# EAGLE design octostep (EAGLE 7.6.0)
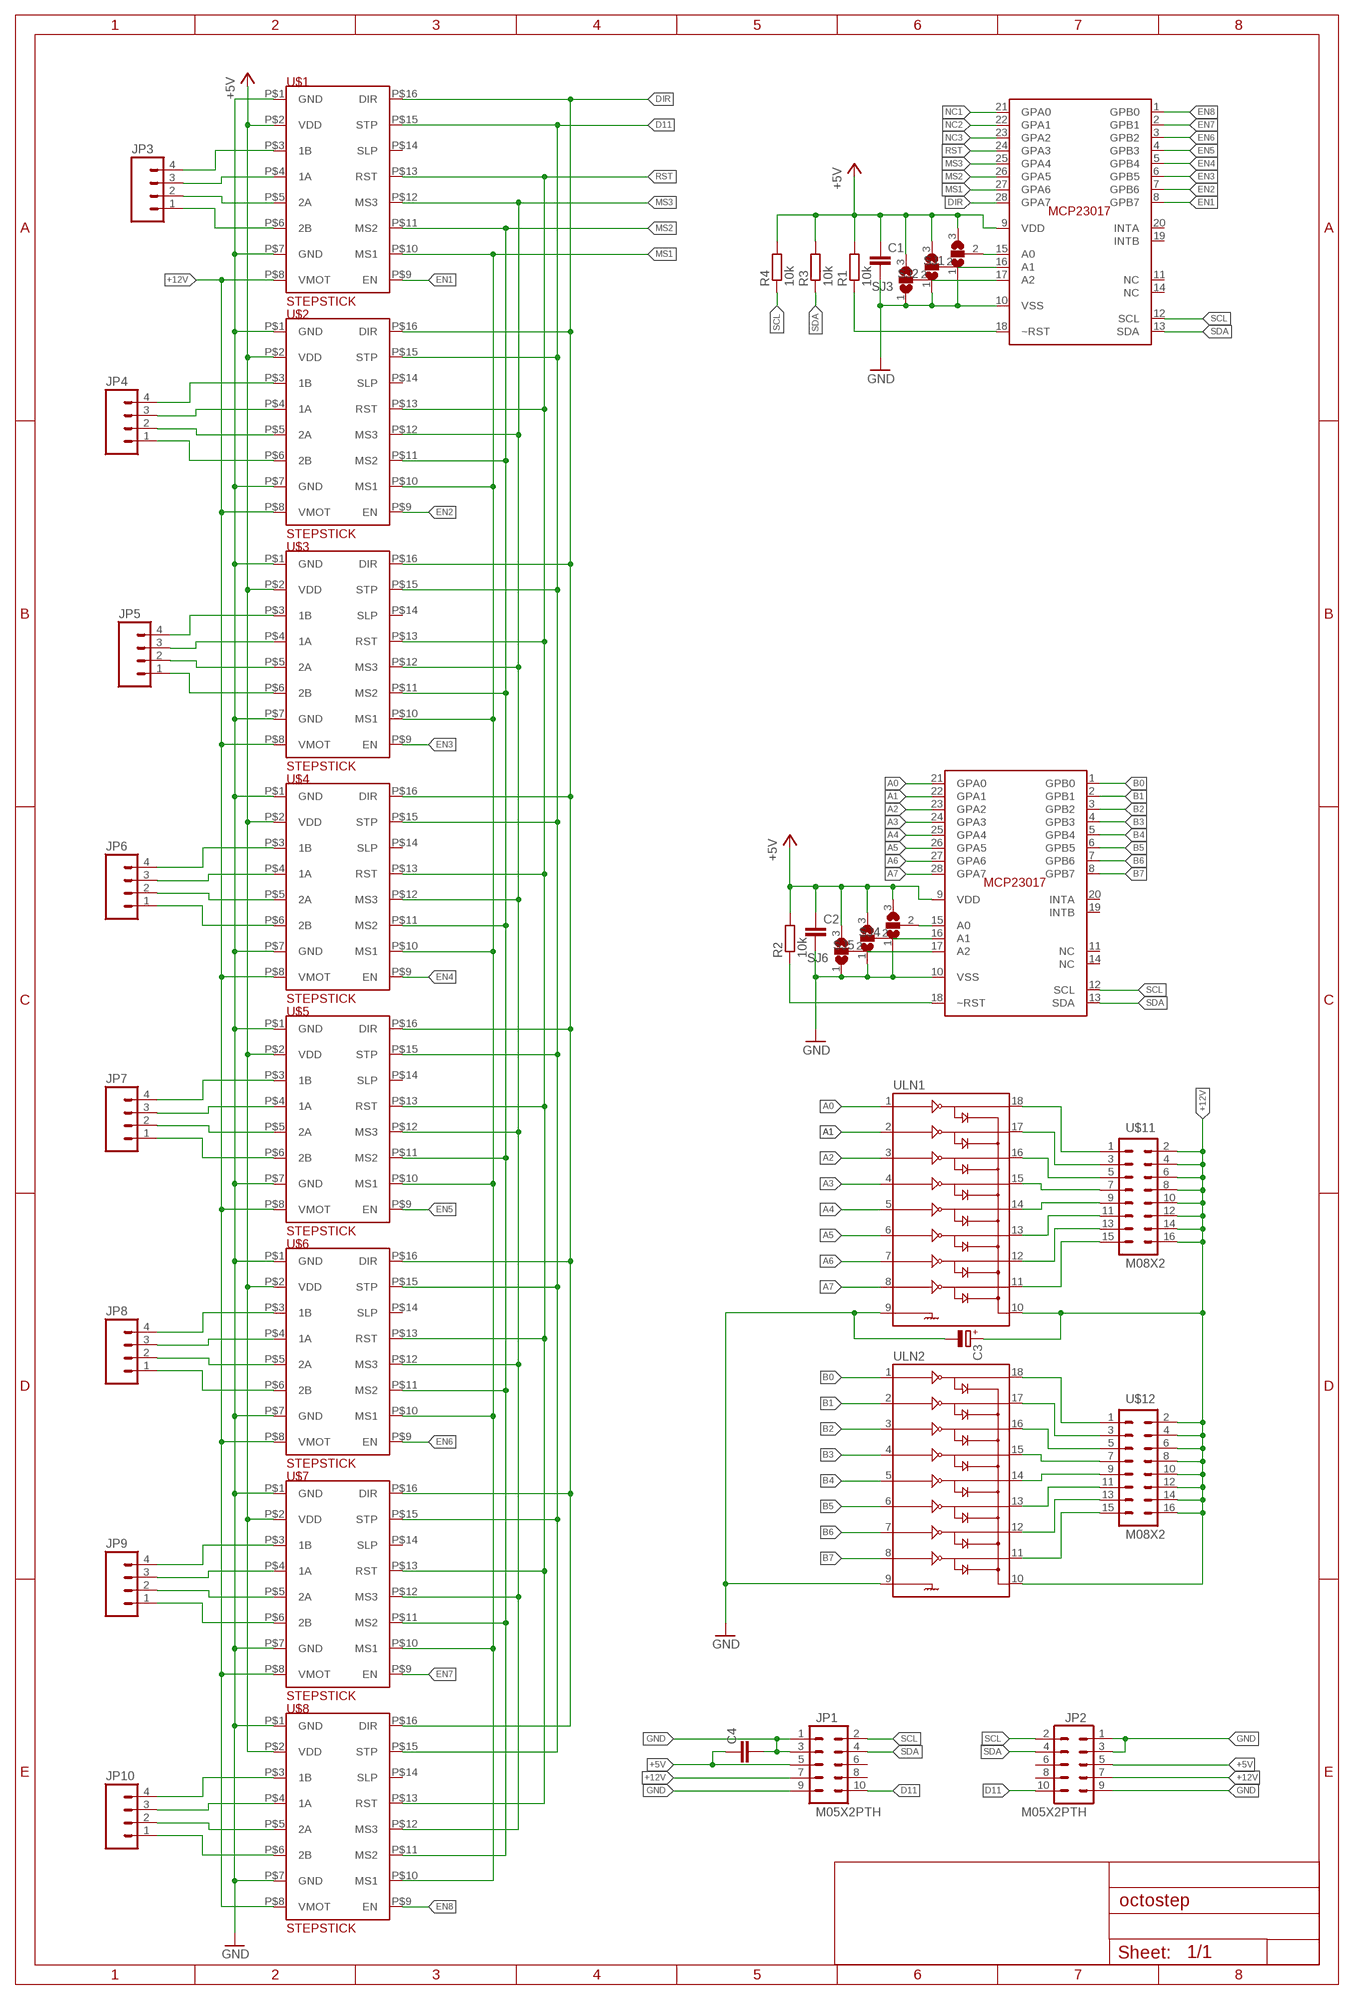
[diagram p0: schematic, sheet 1]

## Parts
C1  CAP0805  [0805]
C2  CAP0805  [0805]
C3  CPOL-EUE3.5-10  [E3,5-10]
C4  C-EUC1206K  [C1206K]
JP1  M05X2PTH  [AVR_ICSP]
JP2  M05X2PTH  [AVR_ICSP]
JP3  M04POLAR  [MOLEX-1X4]
JP4  M04POLAR  [MOLEX-1X4]
JP5  M04POLAR  [MOLEX-1X4]
JP6  M04POLAR  [MOLEX-1X4]
JP7  M04POLAR  [MOLEX-1X4]
JP8  M04POLAR  [MOLEX-1X4]
JP9  M04POLAR  [MOLEX-1X4]
JP10  M04POLAR  [MOLEX-1X4]
R1  10k  R-EU_R0805  [R0805]
R2  10k  R-EU_R0805  [R0805]
R3  10k  R-EU_R0805  [R0805]
R4  10k  R-EU_R0805  [R0805]
SJ1  SJ2W  [SJ_2]
SJ2  SJ2W  [SJ_2]
SJ3  SJ2W  [SJ_2]
SJ4  SJ2W  [SJ_2]
SJ5  SJ2W  [SJ_2]
SJ6  SJ2W  [SJ_2]
U$1  STEPSTICK  [STEPSTICK]
U$2  STEPSTICK  [STEPSTICK]
U$3  STEPSTICK  [STEPSTICK]
U$4  STEPSTICK  [STEPSTICK]
U$5  STEPSTICK  [STEPSTICK]
U$6  STEPSTICK  [STEPSTICK]
U$7  STEPSTICK  [STEPSTICK]
U$8  STEPSTICK  [STEPSTICK]
U$9  MCP23017-E/SO  [SOIC28-W_MC]
U$10  MCP23017-E/SO  [SOIC28-W_MC]
U$11  M08X2  [2X8]
U$12  M08X2  [2X8]
ULN1  ULN2803SOICW  [SO18L]
ULN2  ULN2803SOICW  [SO18L]

## Nets
+5V: C1.1 C2.1 C4.1 JP1.5 JP2.5 R1.2 R2.2 R3.2 R4.2 SJ1.3 SJ2.3 SJ3.3 SJ4.3 SJ5.3 SJ6.3 U$1.P$2(VDD) U$2.P$2(VDD) U$3.P$2(VDD) U$4.P$2(VDD) U$5.P$2(VDD) U$6.P$2(VDD) U$7.P$2(VDD) U$8.P$2(VDD) U$9.9(VDD) U$10.9(VDD)
+12V: C3.+ JP1.7 JP2.7 U$1.P$8(VMOT) U$2.P$8(VMOT) U$3.P$8(VMOT) U$4.P$8(VMOT) U$5.P$8(VMOT) U$6.P$8(VMOT) U$7.P$8(VMOT) U$8.P$8(VMOT) U$11.2 U$11.4 U$11.6 U$11.8 U$11.10 U$11.12 U$11.14 U$11.16 U$12.2 U$12.4 U$12.6 U$12.8 U$12.10 U$12.12 U$12.14 U$12.16 ULN1.10
A0: U$10.21(GPA0) ULN1.1
A1: U$10.22(GPA1) ULN1.2
A2: U$10.23(GPA2) ULN1.3
A3: U$10.24(GPA3) ULN1.4
A4: U$10.25(GPA4) ULN1.5
A5: U$10.26(GPA5) ULN1.6
A6: U$10.27(GPA6) ULN1.7
A7: U$10.28(GPA7) ULN1.8
B0: U$10.1(GPB0) ULN2.1
B1: U$10.2(GPB1) ULN2.2
B2: U$10.3(GPB2) ULN2.3
B3: U$10.4(GPB3) ULN2.4
B4: U$10.5(GPB4) ULN2.5
B5: U$10.6(GPB5) ULN2.6
B6: U$10.7(GPB6) ULN2.7
B7: U$10.8(GPB7) ULN2.8
D11: JP1.10 JP2.10 U$1.P$15(STP) U$2.P$15(STP) U$3.P$15(STP) U$4.P$15(STP) U$5.P$15(STP) U$6.P$15(STP) U$7.P$15(STP) U$8.P$15(STP)
DIR: U$1.P$16(DIR) U$2.P$16(DIR) U$3.P$16(DIR) U$4.P$16(DIR) U$5.P$16(DIR) U$6.P$16(DIR) U$7.P$16(DIR) U$8.P$16(DIR) U$9.28(GPA7)
EN1: U$1.P$9(EN) U$9.8(GPB7)
EN2: U$2.P$9(EN) U$9.7(GPB6)
EN3: U$3.P$9(EN) U$9.6(GPB5)
EN4: U$4.P$9(EN) U$9.5(GPB4)
EN5: U$5.P$9(EN) U$9.4(GPB3)
EN6: U$6.P$9(EN) U$9.3(GPB2)
EN7: U$7.P$9(EN) U$9.2(GPB1)
EN8: U$8.P$9(EN) U$9.1(GPB0)
GND: C1.2 C2.2 C3.- C4.2 JP1.1 JP1.3 JP1.9 JP2.1 JP2.3 JP2.9 SJ1.1 SJ2.1 SJ3.1 SJ4.1 SJ5.1 SJ6.1 U$1.P$1(GND) U$1.P$7(GND) U$2.P$1(GND) U$2.P$7(GND) U$3.P$1(GND) U$3.P$7(GND) U$4.P$1(GND) U$4.P$7(GND) U$5.P$1(GND) U$5.P$7(GND) U$6.P$1(GND) U$6.P$7(GND) U$7.P$1(GND) U$7.P$7(GND) U$8.P$1(GND) U$8.P$7(GND) U$9.10(VSS) U$10.10(VSS) ULN1.9 ULN2.9
MS1: U$1.P$10(MS1) U$2.P$10(MS1) U$3.P$10(MS1) U$4.P$10(MS1) U$5.P$10(MS1) U$6.P$10(MS1) U$7.P$10(MS1) U$8.P$10(MS1) U$9.27(GPA6)
MS2: U$1.P$11(MS2) U$2.P$11(MS2) U$3.P$11(MS2) U$4.P$11(MS2) U$5.P$11(MS2) U$6.P$11(MS2) U$7.P$11(MS2) U$8.P$11(MS2) U$9.26(GPA5)
MS3: U$1.P$12(MS3) U$2.P$12(MS3) U$3.P$12(MS3) U$4.P$12(MS3) U$5.P$12(MS3) U$6.P$12(MS3) U$7.P$12(MS3) U$8.P$12(MS3) U$9.25(GPA4)
N$1: JP3.2 U$1.P$5(2A)
N$2: SJ2.2 U$9.16(A1)
N$4: R1.1 U$9.18(~RST)
N$5: SJ1.2 U$9.15(A0)
N$6: SJ3.2 U$9.17(A2)
N$7: R2.1 U$10.18(~RST)
N$8: SJ4.2 U$10.15(A0)
N$9: SJ5.2 U$10.16(A1)
N$10: SJ6.2 U$10.17(A2)
N$11: JP3.3 U$1.P$4(1A)
N$12: JP3.4 U$1.P$3(1B)
N$13: JP3.1 U$1.P$6(2B)
N$14: JP4.2 U$2.P$5(2A)
N$15: JP4.3 U$2.P$4(1A)
N$16: JP4.4 U$2.P$3(1B)
N$17: JP4.1 U$2.P$6(2B)
N$18: JP5.2 U$3.P$5(2A)
N$19: JP5.3 U$3.P$4(1A)
N$20: JP5.4 U$3.P$3(1B)
N$21: JP5.1 U$3.P$6(2B)
N$22: JP6.2 U$4.P$5(2A)
N$23: JP6.3 U$4.P$4(1A)
N$24: JP6.4 U$4.P$3(1B)
N$25: JP6.1 U$4.P$6(2B)
N$26: JP7.2 U$5.P$5(2A)
N$27: JP7.3 U$5.P$4(1A)
N$28: JP7.4 U$5.P$3(1B)
N$29: JP7.1 U$5.P$6(2B)
N$30: JP8.2 U$6.P$5(2A)
N$31: JP8.3 U$6.P$4(1A)
N$32: JP8.4 U$6.P$3(1B)
N$33: JP8.1 U$6.P$6(2B)
N$34: JP9.2 U$7.P$5(2A)
N$35: JP9.3 U$7.P$4(1A)
N$36: JP9.4 U$7.P$3(1B)
N$37: JP9.1 U$7.P$6(2B)
N$38: JP10.2 U$8.P$5(2A)
N$39: JP10.3 U$8.P$4(1A)
N$40: JP10.4 U$8.P$3(1B)
N$41: JP10.1 U$8.P$6(2B)
N$42: U$11.1 ULN1.18
N$43: U$11.3 ULN1.17
N$44: U$11.5 ULN1.16
N$45: U$11.7 ULN1.15
N$46: U$11.9 ULN1.14
N$47: U$11.11 ULN1.13
N$48: U$11.13 ULN1.12
N$49: U$11.15 ULN1.11
N$50: ULN2.10
N$51: U$12.1 ULN2.18
N$52: U$12.3 ULN2.17
N$53: U$12.5 ULN2.16
N$54: U$12.7 ULN2.15
N$55: U$12.9 ULN2.14
N$56: U$12.11 ULN2.13
N$57: U$12.13 ULN2.12
N$58: U$12.15 ULN2.11
NC1: U$9.21(GPA0)
NC2: U$9.22(GPA1)
NC3: U$9.23(GPA2)
RST: U$1.P$13(RST) U$2.P$13(RST) U$3.P$13(RST) U$4.P$13(RST) U$5.P$13(RST) U$6.P$13(RST) U$7.P$13(RST) U$8.P$13(RST) U$9.24(GPA3)
SCL: JP1.2 JP2.2 R4.1 U$9.12(SCL) U$10.12(SCL)
SDA: JP1.4 JP2.4 R3.1 U$9.13(SDA) U$10.13(SDA)
Unconnected: JP1.6 JP1.8 JP2.6 JP2.8 U$1.P$14(SLP) U$2.P$14(SLP) U$3.P$14(SLP) U$4.P$14(SLP) U$5.P$14(SLP) U$6.P$14(SLP) U$7.P$14(SLP) U$8.P$14(SLP) U$9.11(NC) U$9.14(NC) U$9.19(INTB) U$9.20(INTA) U$10.11(NC) U$10.14(NC) U$10.19(INTB) U$10.20(INTA)

## Library data of the parts
C1 C2 = SparkFun-Capacitors:CAP: Capacitor Standard 0603 ceramic capacitor, and 0.1" leaded capacitor.
C3 = resistor:CPOL-EU: POLARIZED CAPACITOR, European symbol
C4 = resistor:C-EU: CAPACITOR, European symbol
JP1 JP2 = SparkFun-Connectors:M05X2: Header 5x2 Standard 10-pin dual row 0.1" header. Commonly used with AVR-ISP. Use with Spark Fun Electronics SKU: PRT-00778
JP3-JP10 = SparkFun-Connectors:M04: Header 4 Standard 4-pin 0.1" header. Use with straight break away headers (SKU : PRT-00116), right angle break away headers (PRT-00553), swiss pins (PRT-00743), machine pins (PRT-00117), and female headers (PRT-00115). Molex polarized connector foot print use with SKU : PRT-08231 with associated crimp pins and housings. 1MM SMD Version SKU: PRT-10208
R1-R4 = resistor:R-EU_: RESISTOR, European symbol
SJ1-SJ6 = jumper:SJ2W: SMD solder JUMPER
U$1-U$8 = Allegro_By_element14_Batch_1:STEPSTICK
U$9 U$10 = Microchip_By_element14_Batch_1:MCP23017-E/SO
U$11 U$12 = SparkFun-Connectors:M08X2: .1" headers, two rows of 8 each
ULN1 ULN2 = SparkFun-PowerIC:ULN2803: Darlington Driver ULN2803 Darlington array. 500mA max per channel, 8-channel package. Spark Fun Electronics SKU : COM-00312

## Board
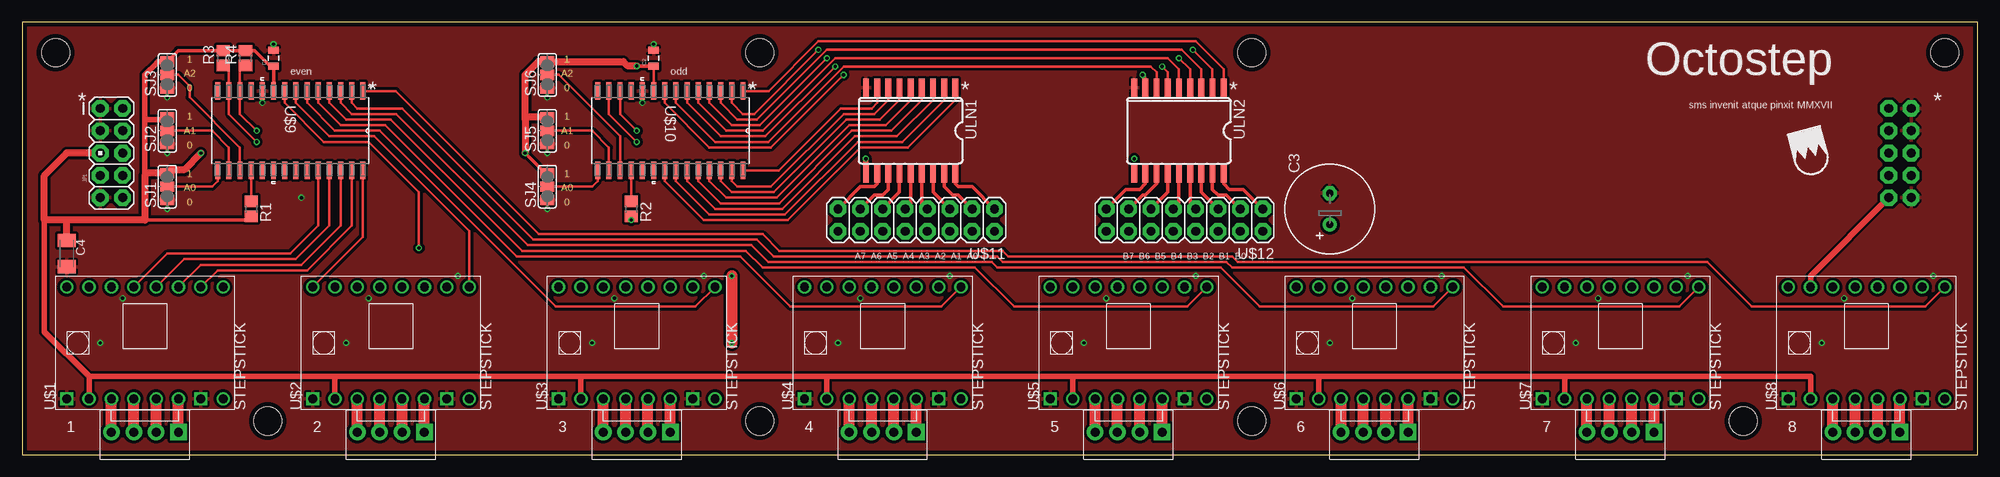
[diagram p1: board, top side]
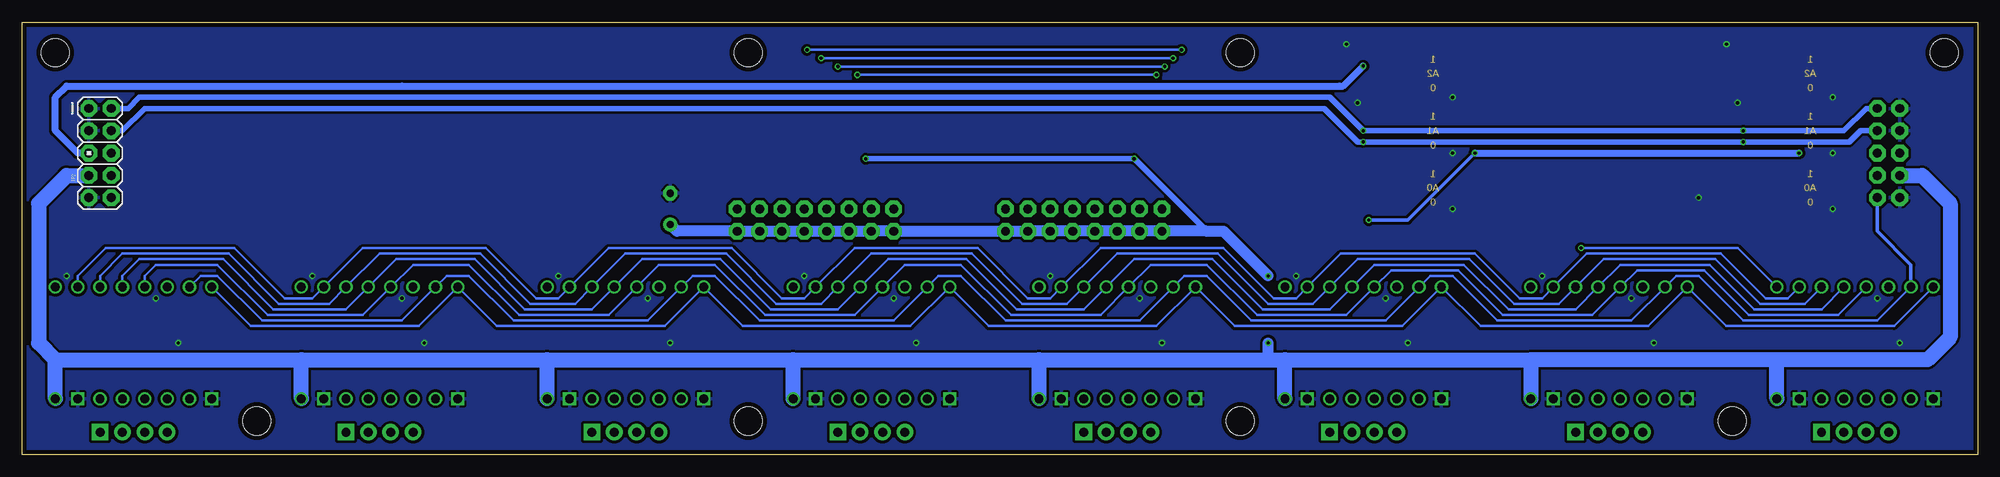
[diagram p2: board, bottom side, seen from below]

Size 222.23 x 49.2 mm. Coordinates in mm from the lower left corner, seen from the top.
Outline: 0,0 222.23,0 222.23,49.2 0,49.2 0,0
Copper layers (1*16): Top 0.035mm / dielectric 1.6mm / Bottom 0.035mm
Design rules "Elecrow_2-layer_PCB_eagle_rule": minimum track width 6mil, minimum drill 12mil, track to track 6mil, track to pad 8mil, pad to pad 12mil, via to via 12mil, smd to smd 0mil, copper to edge 20mil, drill to drill 10mil, minimum pad ring 6mil, minimum via ring 6mil, stop-mask expansion 0mil, vias tented up to drill 100mil, thermal gap 10mil
Holes 3.2 mm at 3.81,45.72 218.44,45.72 139.7,45.72 27.94,3.81 83.82,3.81 139.7,3.81 195.58,3.81 83.82,45.72

### Footprints (pad centres in the part's own frame; a part is rotated, then mirrored left to right if it is on the bottom)
0805 = smd 0.8 x 1.2: 1 -0.9,0; 2 0.9,0
E3,5-10 = drill 0.813 pad 1.6: + -1.778,0 | drill 0.813 pad 1.6 octagon: - 1.778,0
C1206K = smd 1.5 x 2: 1 -1.5,0; 2 1.5,0
AVR_ICSP = drill 1.016 pad 1.88 octagon: 1 -1.27,5.08; 2 1.27,5.08; 3 -1.27,2.54; 4 1.27,2.54; 5 -1.27,0; 6 1.27,0; 7 -1.27,-2.54; 8 1.27,-2.54; 9 -1.27,-5.08; 10 1.27,-5.08
MOLEX-1X4 = drill 1.016 pad 1.88 square: 1 0,0 | drill 1.016 pad 1.88: 2 2.54,0; 3 5.08,0; 4 7.62,0
R0805 = smd 1.3 x 1.5: 1 -0.85,0; 2 0.85,0
SJ_2 = smd 1.168 x 1.6: 1 -1.524,0; 2 0,0; 3 1.524,0
STEPSTICK = drill 1 square: P$1 -6.35,8.89; P$7 -6.35,-6.35 | drill 1: P$2 -6.35,6.35; P$3 -6.35,3.81; P$4 -6.35,1.27; P$5 -6.35,-1.27; P$6 -6.35,-3.81; P$8 -6.35,-8.89; P$9 6.35,-8.89; P$10 6.35,-6.35; P$11 6.35,-3.81; P$12 6.35,-1.27; P$13 6.35,1.27; P$14 6.35,3.81; P$15 6.35,6.35; P$16 6.35,8.89
SOIC28-W_MC = smd 1.981 x 0.559: 1 -4.521,8.255; 2 -4.521,6.985; 3 -4.521,5.715; 4 -4.521,4.445; 5 -4.521,3.175; 6 -4.521,1.905; 7 -4.521,0.635; 8 -4.521,-0.635; 9 -4.521,-1.905; 10 -4.521,-3.175; 11 -4.521,-4.445; 12 -4.521,-5.715; 13 -4.521,-6.985; 14 -4.521,-8.255; 15 4.521,-8.255; 16 4.521,-6.985; 17 4.521,-5.715; 18 4.521,-4.445; 19 4.521,-3.175; 20 4.521,-1.905; 21 4.521,-0.635; 22 4.521,0.635; 23 4.521,1.905; 24 4.521,3.175; 25 4.521,4.445; 26 4.521,5.715; 27 4.521,6.985; 28 4.521,8.255
2X8 = drill 1.016 pad 1.88 octagon: 1 0,0; 2 0,2.54; 3 2.54,0; 4 2.54,2.54; 5 5.08,0; 6 5.08,2.54; 7 7.62,0; 8 7.62,2.54; 9 10.16,0; 10 10.16,2.54; 11 12.7,0; 12 12.7,2.54; 13 15.24,0; 14 15.24,2.54; 15 17.78,0; 16 17.78,2.54
SO18L = smd 0.66 x 2.032: 1 -0.635,-4.902; 2 0.635,-4.902; 3 1.905,-4.902; 4 3.175,-4.902; 5 4.445,-4.902; 6 5.715,-4.902; 7 6.985,-4.902; 8 8.255,-4.902; 9 9.525,-4.902; 10 9.525,4.902; 11 8.255,4.902; 12 6.985,4.902; 13 5.715,4.902; 14 4.445,4.902; 15 3.175,4.902; 16 1.905,4.902; 17 0.635,4.902; 18 -0.635,4.902

### Placement (x,y rotation side)
C1  28.57,45.09 90 top
C2  71.75,45.09 90 top
C3  148.59,27.94 90 top
C4  5.08,22.86 270 top
JP1  10.16,34.29 0 top
JP2  213.36,34.29 0 bottom
JP3  17.78,2.54 180 top
JP4  45.72,2.54 180 top
JP5  73.66,2.54 180 top
JP6  101.6,2.54 180 top
JP7  129.54,2.54 180 top
JP8  157.48,2.54 180 top
JP9  185.42,2.54 180 top
JP10  213.36,2.54 180 top
R1  26.04,27.94 270 top
R2  69.22,27.94 270 top
R3  22.86,45.09 90 top
R4  25.4,45.09 90 top
SJ1  16.51,30.48 90 top
SJ2  16.51,36.83 90 top
SJ3  16.51,43.18 90 top
SJ4  59.69,30.48 90 top
SJ5  59.69,36.83 90 top
SJ6  59.69,43.18 90 top
U$1  13.97,12.7 90 top
U$2  41.91,12.7 90 top
U$3  69.85,12.7 90 top
U$4  97.79,12.7 90 top
U$5  125.73,12.7 90 top
U$6  153.67,12.7 90 top
U$7  181.61,12.7 90 top
U$8  209.55,12.7 90 top
U$9  30.48,36.83 270 top
U$10  73.66,36.83 270 top
U$11  110.49,27.94 180 top
U$12  140.97,27.94 180 top
ULN1  105.41,36.83 180 top
ULN2  135.89,36.83 180 top

### Tracks (layer width: path | path; a pad name or v marks a point on that pad's centre or on a via)
+5V  (via drill 0.38)
  Top 0.305: U$10.9 C2.1 | R1.2 25.82,27.09 25.4,26.67 | C1.1 28.2,44.19 | SJ2.3 16.26,38.1 | 16.26,31.75 SJ1.3
  Top 0.406: U$9.9 C1.1 | 28.2,44.19 26.45,45.94 R4.2 R3.2 17.74,45.94 SJ3.3 | 57.4,38.35 57.15,38.1 | 25.4,26.67 13.97,26.67 | C2.1 v69.85,44.19 | SJ4.3 59.44,32 v57.15,34.29 | R2.2 v69.22,26.67
  Top 0.61: 13.97,31.75 13.97,38.1 | 13.97,38.1 13.97,43.18 15.24,44.45 15.49,44.7 SJ3.3 | 16.26,38.1 13.97,38.1 | U$8.P$2 203.2,8.89 175.26,8.89 | 175.26,8.89 147.32,8.89 | 147.32,8.89 119.38,8.89 | 119.38,8.89 91.44,8.89 | 91.44,8.89 63.5,8.89 | 63.5,8.89 35.56,8.89 | 35.56,8.89 7.62,8.89 | U$1.P$2 7.62,8.89 | U$2.P$2 35.56,8.89 | U$3.P$2 63.5,8.89 | U$4.P$2 91.44,8.89 | U$5.P$2 119.38,8.89 | U$6.P$2 147.32,8.89 | U$7.P$2 175.26,8.89 | 7.62,8.89 2.54,13.97 2.54,26.67
  Top 0.813: SJ5.3 57.4,38.35 | v69.85,44.19 68.84,44.19 68.33,44.7 SJ6.3 58.67,44.7 57.15,43.18 57.15,38.1 v57.15,34.29 | JP1.5 5.08,34.29 2.54,31.75 2.54,26.67 5.08,26.67 | 5.08,26.67 13.97,26.67 13.97,31.75 14.22,32 SJ1.3 16.89,32.38 18.41,32.38 v20.32,34.29 | C4.1 5.08,26.67
  Bottom 0.406: v69.22,26.67 64.77,26.67 v57.15,34.29
  Bottom 0.813: v57.15,34.29 v20.32,34.29 | JP2.5 215.9,34.29 218.44,36.83 218.44,40.64 217.17,41.91 179.07,41.91 72.55,41.91 72.12,41.91 v69.85,44.19
+12V  (via drill 0.38)
  Top 0.61: ULN1.10 v95.89,33.66
  Top 1.27: v80.64,20.32 v80.64,12.7
  Bottom 0.61: 87.63,25.4 v95.89,33.66 v126.36,33.66
  Bottom 1.27: v80.64,20.32 85.72,25.4 87.63,25.4 U$11.16 U$11.14 U$11.12 U$11.10 U$11.8 U$11.6 U$11.4 U$11.2 U$12.16 U$12.14 U$12.12 U$12.10 U$12.8 U$12.6 U$12.4 U$12.2 147.83,25.4 C3.+ | 80.64,10.79 v80.64,12.7
  Bottom 1.676: U$1.P$8 22.86,10.79 | 22.86,10.79 50.8,10.79 | U$3.P$8 78.74,10.79 | 78.74,10.79 50.8,10.79 | U$4.P$8 106.68,10.79 | 106.68,10.79 80.64,10.79 78.74,10.79 | U$5.P$8 134.62,10.79 | 134.62,10.79 106.68,10.79 | U$6.P$8 162.56,10.79 | 162.56,10.79 134.62,10.79 | U$7.P$8 190.5,10.79 | 190.5,10.79 162.56,10.79 | U$8.P$8 218.44,10.79 | 218.44,10.79 190.5,10.79 | 50.8,10.79 U$2.P$8 | 22.86,10.79 5.71,10.79 3.17,13.34 3.17,28.57 6.35,31.75 JP1.7 | 218.44,10.79 220.34,12.7 220.34,28.57 217.17,31.75 JP2.7
A0
  Top 0.305: ULN1.1 106.05,40.32 100.65,34.92 95.25,34.92 87,26.67 77.47,26.67 73.03,31.11 U$10.21
A1
  Top 0.305: U$10.22 74.3,31.11 78.11,27.3 86.68,27.3 94.93,35.56 100.01,35.56 104.78,40.32 ULN1.2
A2
  Top 0.305: U$10.23 75.56,31.11 78.74,27.94 86.36,27.94 94.61,36.2 99.38,36.2 103.5,40.32 ULN1.3
A3
  Top 0.305: U$10.24 76.83,31.11 79.38,28.57 86.04,28.57 94.3,36.83 98.74,36.83 102.23,40.32 ULN1.4
A4
  Top 0.305: U$10.25 78.11,31.11 80.01,29.21 85.72,29.21 93.98,37.47 98.11,37.47 100.97,40.32 ULN1.5
A5
  Top 0.305: U$10.26 79.38,31.11 80.64,29.84 85.41,29.84 93.66,38.1 97.47,38.1 99.69,40.32 ULN1.6
A6
  Top 0.305: ULN1.7 98.42,40.32 96.84,38.73 93.34,38.73 85.09,30.48 81.28,30.48 80.64,31.11 U$10.27
A7
  Top 0.305: U$10.28 85.97,32.31 93.03,39.37 96.52,39.37 97.16,40.01 ULN1.8
B0
  Top 0.305: ULN2.1 136.53,43.81 133.35,46.99 90.49,46.99 84.85,41.35 U$10.1
B1  (via drill 0.38)
  Top 0.305: U$10.2 80.64,40.01 81.92,38.73 83.19,38.73 v90.49,46.04 | v133.03,46.04 135.25,43.81 ULN2.2
  Bottom 0.305: v90.49,46.04 v133.03,46.04
B2
  Top 0.305: U$10.3 79.38,40.01 81.28,38.1 83.5,38.1 91.44,46.04 131.76,46.04 133.99,43.81 ULN2.3
B3  (via drill 0.38)
  Top 0.305: U$10.4 78.11,40.01 80.64,37.47 83.82,37.47 v91.44,45.09 | v131.44,45.09 132.72,43.81 ULN2.4
  Bottom 0.305: v91.44,45.09 v131.44,45.09
B4
  Top 0.305: U$10.5 76.83,40.01 80.01,36.83 84.14,36.83 92.39,45.09 130.18,45.09 131.44,43.81 ULN2.5
B5  (via drill 0.38)
  Top 0.305: U$10.6 75.56,40.01 79.38,36.2 84.45,36.2 v92.39,44.13 | ULN2.6 130.18,43.5 v129.54,44.13
  Bottom 0.305: v92.39,44.13 v129.54,44.13
B6
  Top 0.305: U$10.7 74.3,40.01 78.74,35.56 84.77,35.56 93.34,44.13 128.27,44.13 128.91,43.5 ULN2.7
B7  (via drill 0.38)
  Top 0.305: U$10.8 73.03,40.01 78.11,34.92 85.09,34.92 v93.34,43.18 | ULN2.8 127.64,42.86 v127.32,43.18
  Bottom 0.305: v93.34,43.18 v127.32,43.18
D11
  Top 0.61: U$8.P$15 203.2,20.32 JP2.10
  Bottom 0.305: U$8.P$15 201.93,20.32 200.03,20.32 194.94,15.24 179.07,15.24 U$7.P$15 173.99,20.32 171.45,20.32 166.37,15.24 151.13,15.24 U$6.P$15 146.05,20.32 143.51,20.32 138.43,15.24 123.19,15.24 U$5.P$15 118.11,20.32 115.57,20.32 110.49,15.24 95.25,15.24 U$4.P$15 90.17,20.32 87.63,20.32 82.55,15.24 67.31,15.24 U$3.P$15 62.23,20.32 59.69,20.32 54.61,15.24 39.37,15.24 U$2.P$15 34.29,20.32 31.75,20.32 26.67,15.24 11.43,15.24 U$1.P$15
  Bottom 0.406: U$1.P$15 7.62,21.59 11.43,25.4 JP1.10
DIR
  Top 0.305: U$9.28 38.73,24.77 U$2.P$16
  Bottom 0.305: U$8.P$16 196.22,14.61 177.16,14.61 U$7.P$16 168.28,14.61 149.22,14.61 U$6.P$16 140.34,14.61 121.28,14.61 U$5.P$16 112.39,14.61 93.34,14.61 U$4.P$16 84.45,14.61 65.41,14.61 U$3.P$16 56.52,14.61 37.47,14.61 U$2.P$16 28.57,14.61 9.53,14.61 U$1.P$16
EN1  (via drill 0.38)
  Top 0.305: U$9.8 29.84,40.01 34.29,35.56 39.37,35.56 45.09,29.84 v45.09,23.5
  Bottom 0.305: U$1.P$9 27.3,23.5 v45.09,23.5
EN2
  Top 0.305: U$9.7 31.11,40.01 34.92,36.2 40.01,36.2 50.8,25.4 U$2.P$9
EN3
  Top 0.305: U$3.P$9 76.52,16.83 60.64,16.83 40.64,36.83 35.56,36.83 32.38,40.01 U$9.6
EN4
  Top 0.305: U$4.P$9 104.46,16.83 87.31,16.83 81.6,22.54 56.2,22.54 41.27,37.47 36.2,37.47 33.66,40.01 U$9.5
EN5
  Top 0.305: U$5.P$9 132.4,16.83 112.71,16.83 108.27,21.27 84.14,21.27 82.23,23.18 56.83,23.18 41.91,38.1 36.83,38.1 34.92,40.01 U$9.4
EN6
  Top 0.305: U$6.P$9 160.34,16.83 140.65,16.83 136.21,21.27 110.81,21.27 110.17,21.91 84.77,21.91 82.87,23.81 57.47,23.81 42.55,38.73 37.47,38.73 36.2,40.01 U$9.3
EN7
  Top 0.305: U$7.P$9 188.28,16.83 168.28,16.83 163.83,21.27 137.48,21.27 136.84,21.91 111.44,21.91 110.81,22.54 85.41,22.54 83.5,24.45 58.1,24.45 43.18,39.37 38.1,39.37 37.47,40.01 U$9.2
EN8
  Top 0.305: U$8.P$9 216.22,16.83 196.53,16.83 191.45,21.91 138.11,21.91 137.48,22.54 112.08,22.54 111.44,23.18 86.04,23.18 84.14,25.08 58.74,25.08 42.47,41.35 U$9.1
GND  (via drill 0.38)
  Top 0.305: SJ3.1 v16.51,40.64 | SJ2.1 v16.51,34.29 | SJ1.1 v16.51,27.94 | C1.2 v28.57,46.67 | U$9.10 v27.3,40.01 | SJ4.1 v59.69,27.94 | SJ5.1 v59.69,34.29 | SJ6.1 v59.69,40.64 | U$10.10 v70.48,40.01 | C2.2 v71.75,46.67
  other vias: 8.89,12.7 36.83,12.7 64.77,12.7 92.71,12.7 120.65,12.7 148.59,12.7 176.53,12.7 204.47,12.7 11.43,17.78 39.37,17.78 67.31,17.78 95.25,17.78 123.19,17.78 151.13,17.78 179.07,17.78 207.01,17.78 189.23,20.32 217.17,20.32 161.29,20.32 133.35,20.32 105.41,20.32 77.47,20.32 49.53,20.32 31.75,29.21
  pour Bottom (isolate 0.305): -3.81,52.07 224.79,52.07 224.79,-2.54 -3.81,-2.54
  pour Top (isolate 0.305): -1.27,53.34 224.79,52.07 224.79,-2.54 -1.27,-1.27
MS1
  Top 0.305: U$9.27 37.47,26.04 32.38,20.95 22.23,20.95 U$1.P$10
  Bottom 0.305: U$8.P$10 215.9,20.32 212.72,23.5 198.12,23.5 192.41,17.78 189.23,17.78 U$7.P$10 183.51,23.5 169.54,23.5 163.83,17.78 161.29,17.78 U$6.P$10 155.57,23.5 141.6,23.5 135.89,17.78 133.35,17.78 U$5.P$10 127.64,23.5 113.67,23.5 107.95,17.78 105.41,17.78 U$4.P$10 99.69,23.5 85.72,23.5 80.01,17.78 77.47,17.78 U$3.P$10 72.39,22.86 57.15,22.86 52.07,17.78 49.53,17.78 U$2.P$10 44.45,22.86 29.21,22.86 24.13,17.78 21.59,17.78 U$1.P$10
MS2
  Top 0.305: U$9.26 36.2,26.04 31.75,21.59 20.32,21.59 U$1.P$11
  Bottom 0.305: U$8.P$11 213.36,20.32 210.82,22.86 198.75,22.86 193.04,17.14 187.32,17.14 U$7.P$11 181.61,22.86 170.18,22.86 164.47,17.14 159.38,17.14 U$6.P$11 153.67,22.86 142.24,22.86 136.53,17.14 131.44,17.14 U$5.P$11 125.73,22.86 114.3,22.86 108.58,17.14 103.5,17.14 U$4.P$11 97.79,22.86 86.36,22.86 80.64,17.14 75.56,17.14 U$3.P$11 70.48,22.23 57.78,22.23 52.7,17.14 47.62,17.14 U$2.P$11 42.55,22.23 29.84,22.23 24.77,17.14 19.68,17.14 U$1.P$11
MS3
  Top 0.305: U$9.25 34.92,26.04 31.11,22.23 18.41,22.23 U$1.P$12
  Bottom 0.305: U$8.P$12 210.82,20.32 208.91,22.23 199.39,22.23 193.68,16.51 185.42,16.51 U$7.P$12 179.71,22.23 170.81,22.23 165.1,16.51 157.48,16.51 U$6.P$12 151.76,22.23 142.88,22.23 137.16,16.51 129.54,16.51 U$5.P$12 123.83,22.23 114.94,22.23 109.22,16.51 101.6,16.51 U$4.P$12 95.89,22.23 87,22.23 81.28,16.51 73.66,16.51 U$3.P$12 68.58,21.59 58.42,21.59 53.34,16.51 45.72,16.51 U$2.P$12 40.64,21.59 30.48,21.59 25.4,16.51 17.78,16.51 U$1.P$12
N$1
  Top 1.27: JP3.2 U$1.P$5
N$2
  Top 0.305: SJ2.2 21.59,36.83 23.5,34.92 U$9.16
N$4
  Top 0.305: U$9.18 R1.1
N$5
  Top 0.305: SJ1.2 21.59,30.48 22.23,31.11 U$9.15
N$6
  Top 0.305: SJ3.2 17.78,43.18 19.05,41.91 19.05,40.64 24.77,34.92 U$9.17
N$7
  Top 0.305: U$10.18 R2.1
N$8
  Top 0.305: U$10.15 65.41,31.11 64.77,30.48 SJ4.2
N$9
  Top 0.305: SJ5.2 64.77,36.83 66.67,34.92 U$10.16
N$10
  Top 0.305: SJ6.2 60.96,43.18 67.94,36.2 U$10.17
N$11
  Top 1.27: JP3.3 U$1.P$4
N$12
  Top 1.27: JP3.4 U$1.P$3
N$13
  Top 1.27: JP3.1 U$1.P$6
N$14
  Top 1.27: JP4.2 U$2.P$5
N$15
  Top 1.27: JP4.3 U$2.P$4
N$16
  Top 1.27: JP4.4 U$2.P$3
N$17
  Top 1.27: JP4.1 U$2.P$6
N$18
  Top 1.27: JP5.2 U$3.P$5
N$19
  Top 1.27: JP5.3 U$3.P$4
N$20
  Top 1.27: JP5.4 U$3.P$3
N$21
  Top 1.27: JP5.1 U$3.P$6
N$22
  Top 1.27: JP6.2 U$4.P$5
N$23
  Top 1.27: JP6.3 U$4.P$4
N$24
  Top 1.27: JP6.4 U$4.P$3
N$25
  Top 1.27: JP6.1 U$4.P$6
N$26
  Top 1.27: JP7.2 U$5.P$5
N$27
  Top 1.27: JP7.3 U$5.P$4
N$28
  Top 1.27: JP7.4 U$5.P$3
N$29
  Top 1.27: JP7.1 U$5.P$6
N$30
  Top 1.27: JP8.2 U$6.P$5
N$31
  Top 1.27: JP8.3 U$6.P$4
N$32
  Top 1.27: JP8.4 U$6.P$3
N$33
  Top 1.27: JP8.1 U$6.P$6
N$34
  Top 1.27: JP9.2 U$7.P$5
N$35
  Top 1.27: JP9.3 U$7.P$4
N$36
  Top 1.27: JP9.4 U$7.P$3
N$37
  Top 1.27: JP9.1 U$7.P$6
N$38
  Top 1.27: JP10.2 U$8.P$5
N$39
  Top 1.27: JP10.3 U$8.P$4
N$40
  Top 1.27: JP10.4 U$8.P$3
N$41
  Top 1.27: JP10.1 U$8.P$6
N$42
  Top 0.406: ULN1.18 106.05,30.8 106.36,30.48 107.95,30.48 U$11.1
N$43
  Top 0.406: ULN1.17 104.78,30.48 105.73,29.53 106.36,29.53 U$11.3
N$44
  Top 0.406: ULN1.16 103.5,29.84 U$11.5
N$45
  Top 0.406: ULN1.15 102.23,28.57 U$11.7
N$46
  Top 0.406: ULN1.14 100.97,28.57 U$11.9
N$47
  Top 0.406: ULN1.13 99.69,29.84 U$11.11
N$48
  Top 0.406: ULN1.12 98.42,30.16 97.79,29.53 96.84,29.53 U$11.13
N$49
  Top 0.406: ULN1.11 97.16,30.8 96.84,30.48 95.25,30.48 U$11.15
N$51
  Top 0.406: ULN2.18 136.53,30.8 137.16,30.16 138.75,30.16 U$12.1
N$52
  Top 0.406: ULN2.17 135.25,30.16 135.89,29.53 136.84,29.53 U$12.3
N$53
  Top 0.406: ULN2.16 133.99,29.84 U$12.5
N$54
  Top 0.406: ULN2.15 132.72,28.57 U$12.7
N$55
  Top 0.406: ULN2.14 131.44,28.57 U$12.9
N$56
  Top 0.406: ULN2.13 130.18,29.84 U$12.11
N$57
  Top 0.406: U$12.13 127.32,29.53 127.64,29.53 128.91,30.8 ULN2.12
N$58
  Top 0.406: ULN2.11 127.64,30.8 127,30.16 125.41,30.16 U$12.15
RST
  Top 0.305: U$9.24 33.66,26.04 30.48,22.86 16.51,22.86 U$1.P$13
  Bottom 0.305: U$8.P$13 208.28,20.32 207.01,21.59 200.03,21.59 194.31,15.88 183.51,15.88 U$7.P$13 177.8,21.59 171.45,21.59 165.74,15.88 155.57,15.88 U$6.P$13 149.86,21.59 143.51,21.59 137.79,15.88 127.64,15.88 U$5.P$13 121.92,21.59 115.57,21.59 109.86,15.88 99.69,15.88 U$4.P$13 93.98,21.59 87.63,21.59 81.92,15.88 71.75,15.88 U$3.P$13 66.67,20.95 59.05,20.95 53.98,15.88 43.81,15.88 U$2.P$13 38.73,20.95 31.11,20.95 26.04,15.88 15.88,15.88 U$1.P$13
SCL  (via drill 0.38)
  Top 0.305: R4.1 24.77,43.6 U$9.12 24.77,38.73 v26.67,36.83 | v69.85,36.83 67.94,38.73 U$10.12
  Bottom 0.61: JP1.2 12.7,39.37 15.24,36.83 v26.67,36.83 v69.85,36.83 73.66,40.64 208.91,40.64 210.19,39.37 JP2.2
SDA  (via drill 0.38)
  Top 0.305: R3.1 23.5,43.6 U$9.13 23.5,38.73 v26.67,35.56 | v69.85,35.56 66.67,38.73 U$10.13
  Bottom 0.61: JP1.4 13.34,36.83 14.61,35.56 v26.67,35.56 v69.85,35.56 70.48,35.56 74.3,39.37 208.28,39.37 210.82,36.83 JP2.4

### Text on the board
Dimension: 1 / A2 / 0 / / 1 / A1 / 0 / / 1 / A0 / 0 | 1 / A2 / 0 / / 1 / A1 / 0 / / 1 / A0 / 0
_tsilk: even | odd | Octostep | * | * | * | * | * | sms invenit atque pinxit MMXVII | * | A7 A6 A5 A4 A3 A2 A1 A0 | B7 B6 B5 B4 B3 B2 B1 B0 | 1 | 2 | 3 | 4 | 5 | 6 | 7 | 8